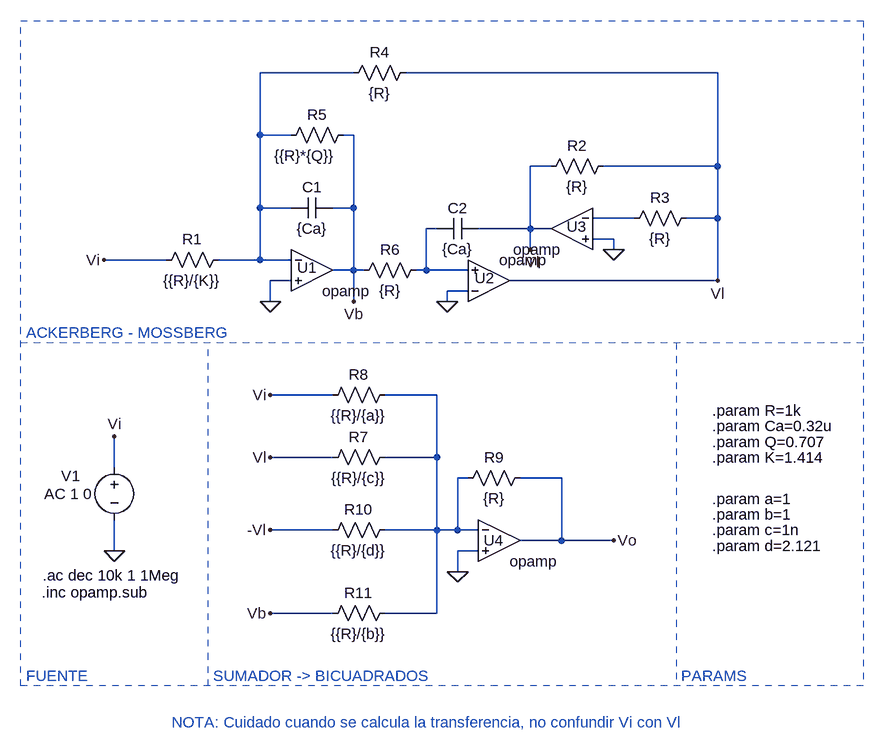
[diagram p0: schematic FullAckerbergMossberg.asc]
FullAckerbergMossberg.asc, the LTspice schematic file:
Version 4
SHEET 1 1388 952
WIRE -304 -64 -448 -64
WIRE 256 -64 -224 -64
WIRE -448 32 -448 -64
WIRE -400 32 -448 32
WIRE -304 32 -320 32
WIRE 0 80 -32 80
WIRE 256 80 256 -64
WIRE 256 80 80 80
WIRE -448 144 -448 32
WIRE -400 144 -448 144
WIRE -304 144 -304 32
WIRE -304 144 -336 144
WIRE 128 160 64 160
WIRE 256 160 256 80
WIRE 256 160 208 160
WIRE -176 176 -192 176
WIRE -32 176 -32 80
WIRE -32 176 -112 176
WIRE 0 176 -32 176
WIRE 96 192 64 192
WIRE -32 208 -32 176
WIRE 96 208 96 192
WIRE -592 224 -688 224
WIRE -448 224 -448 144
WIRE -448 224 -512 224
WIRE -400 224 -448 224
WIRE -304 240 -304 144
WIRE -304 240 -336 240
WIRE -288 240 -304 240
WIRE -192 240 -192 176
WIRE -192 240 -208 240
WIRE -128 240 -192 240
WIRE -400 256 -432 256
WIRE 256 256 256 160
WIRE 256 256 -64 256
WIRE -128 272 -160 272
WIRE -432 288 -432 256
WIRE -304 288 -304 240
WIRE -160 288 -160 272
WIRE -336 432 -432 432
WIRE -176 432 -256 432
WIRE -336 528 -432 528
WIRE -176 528 -176 432
WIRE -176 528 -256 528
WIRE -672 544 -672 496
WIRE -128 560 -144 560
WIRE 16 560 -48 560
WIRE -336 640 -432 640
WIRE -176 640 -176 528
WIRE -176 640 -256 640
WIRE -144 640 -144 560
WIRE -144 640 -176 640
WIRE -112 640 -144 640
WIRE 16 656 16 560
WIRE 16 656 -48 656
WIRE 96 656 16 656
WIRE -672 672 -672 624
WIRE -112 672 -144 672
WIRE -144 704 -144 672
WIRE -336 768 -432 768
WIRE -176 768 -176 640
WIRE -176 768 -256 768
FLAG -432 288 0
FLAG 96 208 0
FLAG -160 288 0
FLAG 256 256 Vl
FLAG -32 208 -Vl
FLAG -304 288 Vb
FLAG -688 224 Vi
FLAG -672 672 0
FLAG -672 496 Vi
FLAG 96 656 Vo
FLAG -432 432 Vi
FLAG -432 528 Vl
FLAG -432 640 -Vl
FLAG -432 768 Vb
FLAG -144 704 0
SYMBOL voltage -672 528 R0
WINDOW 0 -82 29 Left 2
WINDOW 123 -108 56 Left 2
WINDOW 39 0 0 Left 0
SYMATTR InstName V1
SYMATTR Value ""
SYMATTR Value2 AC 1 0
SYMBOL res -496 208 R90
WINDOW 0 0 56 VBottom 2
WINDOW 3 32 56 VTop 2
SYMATTR InstName R1
SYMATTR Value {{R}/{K}}
SYMBOL OpAmps\\opamp -368 176 R0
WINDOW 0 -23 60 Left 2
SYMATTR InstName U1
SYMBOL OpAmps\\opamp -96 320 M180
WINDOW 0 -22 68 Left 2
SYMATTR InstName U2
SYMBOL OpAmps\\opamp 32 112 M0
WINDOW 0 -23 61 Left 2
SYMATTR InstName U3
SYMBOL res 96 64 R90
WINDOW 0 0 56 VBottom 2
WINDOW 3 32 56 VTop 2
SYMATTR InstName R2
SYMATTR Value {R}
SYMBOL res 224 144 R90
WINDOW 0 0 56 VBottom 2
WINDOW 3 32 56 VTop 2
SYMATTR InstName R3
SYMATTR Value {R}
SYMBOL res -208 -80 R90
WINDOW 0 0 56 VBottom 2
WINDOW 3 32 56 VTop 2
SYMATTR InstName R4
SYMATTR Value {R}
SYMBOL res -304 16 R90
WINDOW 0 0 56 VBottom 2
WINDOW 3 32 75 VTop 2
SYMATTR InstName R5
SYMATTR Value {{R}*{Q}}
SYMBOL cap -336 128 R90
WINDOW 0 0 32 VBottom 2
WINDOW 3 32 32 VTop 2
SYMATTR InstName C1
SYMATTR Value {Ca}
SYMBOL res -192 224 R90
WINDOW 0 0 56 VBottom 2
WINDOW 3 32 56 VTop 2
SYMATTR InstName R6
SYMATTR Value {R}
SYMBOL res -240 512 R90
WINDOW 0 0 56 VBottom 2
WINDOW 3 32 56 VTop 2
SYMATTR InstName R7
SYMATTR Value {{R}/{c}}
SYMBOL res -240 416 R90
WINDOW 0 0 56 VBottom 2
WINDOW 3 32 56 VTop 2
SYMATTR InstName R8
SYMATTR Value {{R}/{a}}
SYMBOL res -32 544 R90
WINDOW 0 0 56 VBottom 2
WINDOW 3 32 56 VTop 2
SYMATTR InstName R9
SYMATTR Value {R}
SYMBOL res -240 624 R90
WINDOW 0 0 56 VBottom 2
WINDOW 3 32 56 VTop 2
SYMATTR InstName R10
SYMATTR Value {{R}/{d}}
SYMBOL res -240 752 R90
WINDOW 0 0 56 VBottom 2
WINDOW 3 32 56 VTop 2
SYMATTR InstName R11
SYMATTR Value {{R}/{b}}
SYMBOL OpAmps\\opamp -80 592 R0
WINDOW 0 -24 64 Left 2
SYMATTR InstName U4
SYMBOL cap -112 160 R90
WINDOW 0 0 32 VBottom 2
WINDOW 3 32 32 VTop 2
SYMATTR InstName C2
SYMATTR Value {Ca}
TEXT 248 456 Left 2 !.param R=1k
TEXT 248 480 Left 2 !.param Ca=0.32u
TEXT 248 504 Left 2 !.param Q=0.707
TEXT 248 528 Left 2 !.param K=1.414
TEXT 248 592 Left 2 !.param a=1
TEXT 248 616 Left 2 !.param b=1
TEXT 248 640 Left 2 !.param c=1n
TEXT 248 664 Left 2 !.param d=2.121
TEXT -782 710 Left 2 !.ac dec 10k 1 1Meg
TEXT -784 736 Left 2 !.inc opamp.sub
TEXT -808 864 Left 2 ;FUENTE
TEXT -520 864 Left 2 ;SUMADOR -> BICUADRADOS
TEXT 200 864 Left 2 ;PARAMS
TEXT -808 336 Left 2 ;ACKERBERG - MOSSBERG
TEXT -584 936 Left 2 ;NOTA: Cuidado cuando se calcula la transferencia, no confundir Vi con Vl
LINE Normal 480 352 -816 352 2
LINE Normal -528 880 -528 352 2
LINE Normal 192 352 192 880 2
RECTANGLE Normal 480 880 -816 -144 2

The netlist it stands for:
* FullAckerbergMossberg.asc
V1 Vi 0 AC 1 0
R1 N001 Vi {{R}/{K}}
XU1 N001 0 Vb opamp Aol=100K GBW=10Meg  ; pins invin noninvin out
XU2 0 N003 Vl opamp Aol=100K GBW=10Meg  ; pins invin noninvin out
XU3 N002 0 -Vl opamp Aol=100K GBW=10Meg  ; pins invin noninvin out
R2 Vl -Vl {R}
R3 Vl N002 {R}
R4 Vl N001 {R}
R5 Vb N001 {{R}*{Q}}
C1 Vb N001 {Ca}
R6 N003 Vb {R}
R7 N004 Vl {{R}/{c}}
R8 N004 Vi {{R}/{a}}
R9 Vo N004 {R}
R10 N004 -Vl {{R}/{d}}
R11 N004 Vb {{R}/{b}}
XU4 N004 0 Vo opamp Aol=100K GBW=10Meg  ; pins invin noninvin out
C2 -Vl N003 {Ca}
.param R=1k
.param Ca=0.32u
.param Q=0.707
.param K=1.414
.param a=1
.param b=1
.param c=1n
.param d=2.121
.ac dec 10k 1 1Meg
.inc opamp.sub
* FUENTE
* SUMADOR -> BICUADRADOS
* PARAMS
* ACKERBERG - MOSSBERG
* NOTA: Cuidado cuando se calcula la transferencia, no confundir Vi con Vl
.backanno
.end